# EasyEDA schematic SCH_Device_2024-05-04.json
TITLE: CodexScope; REV: 1.0; Date: 2024-04-23; Sheet: 1/1; Company: N/A
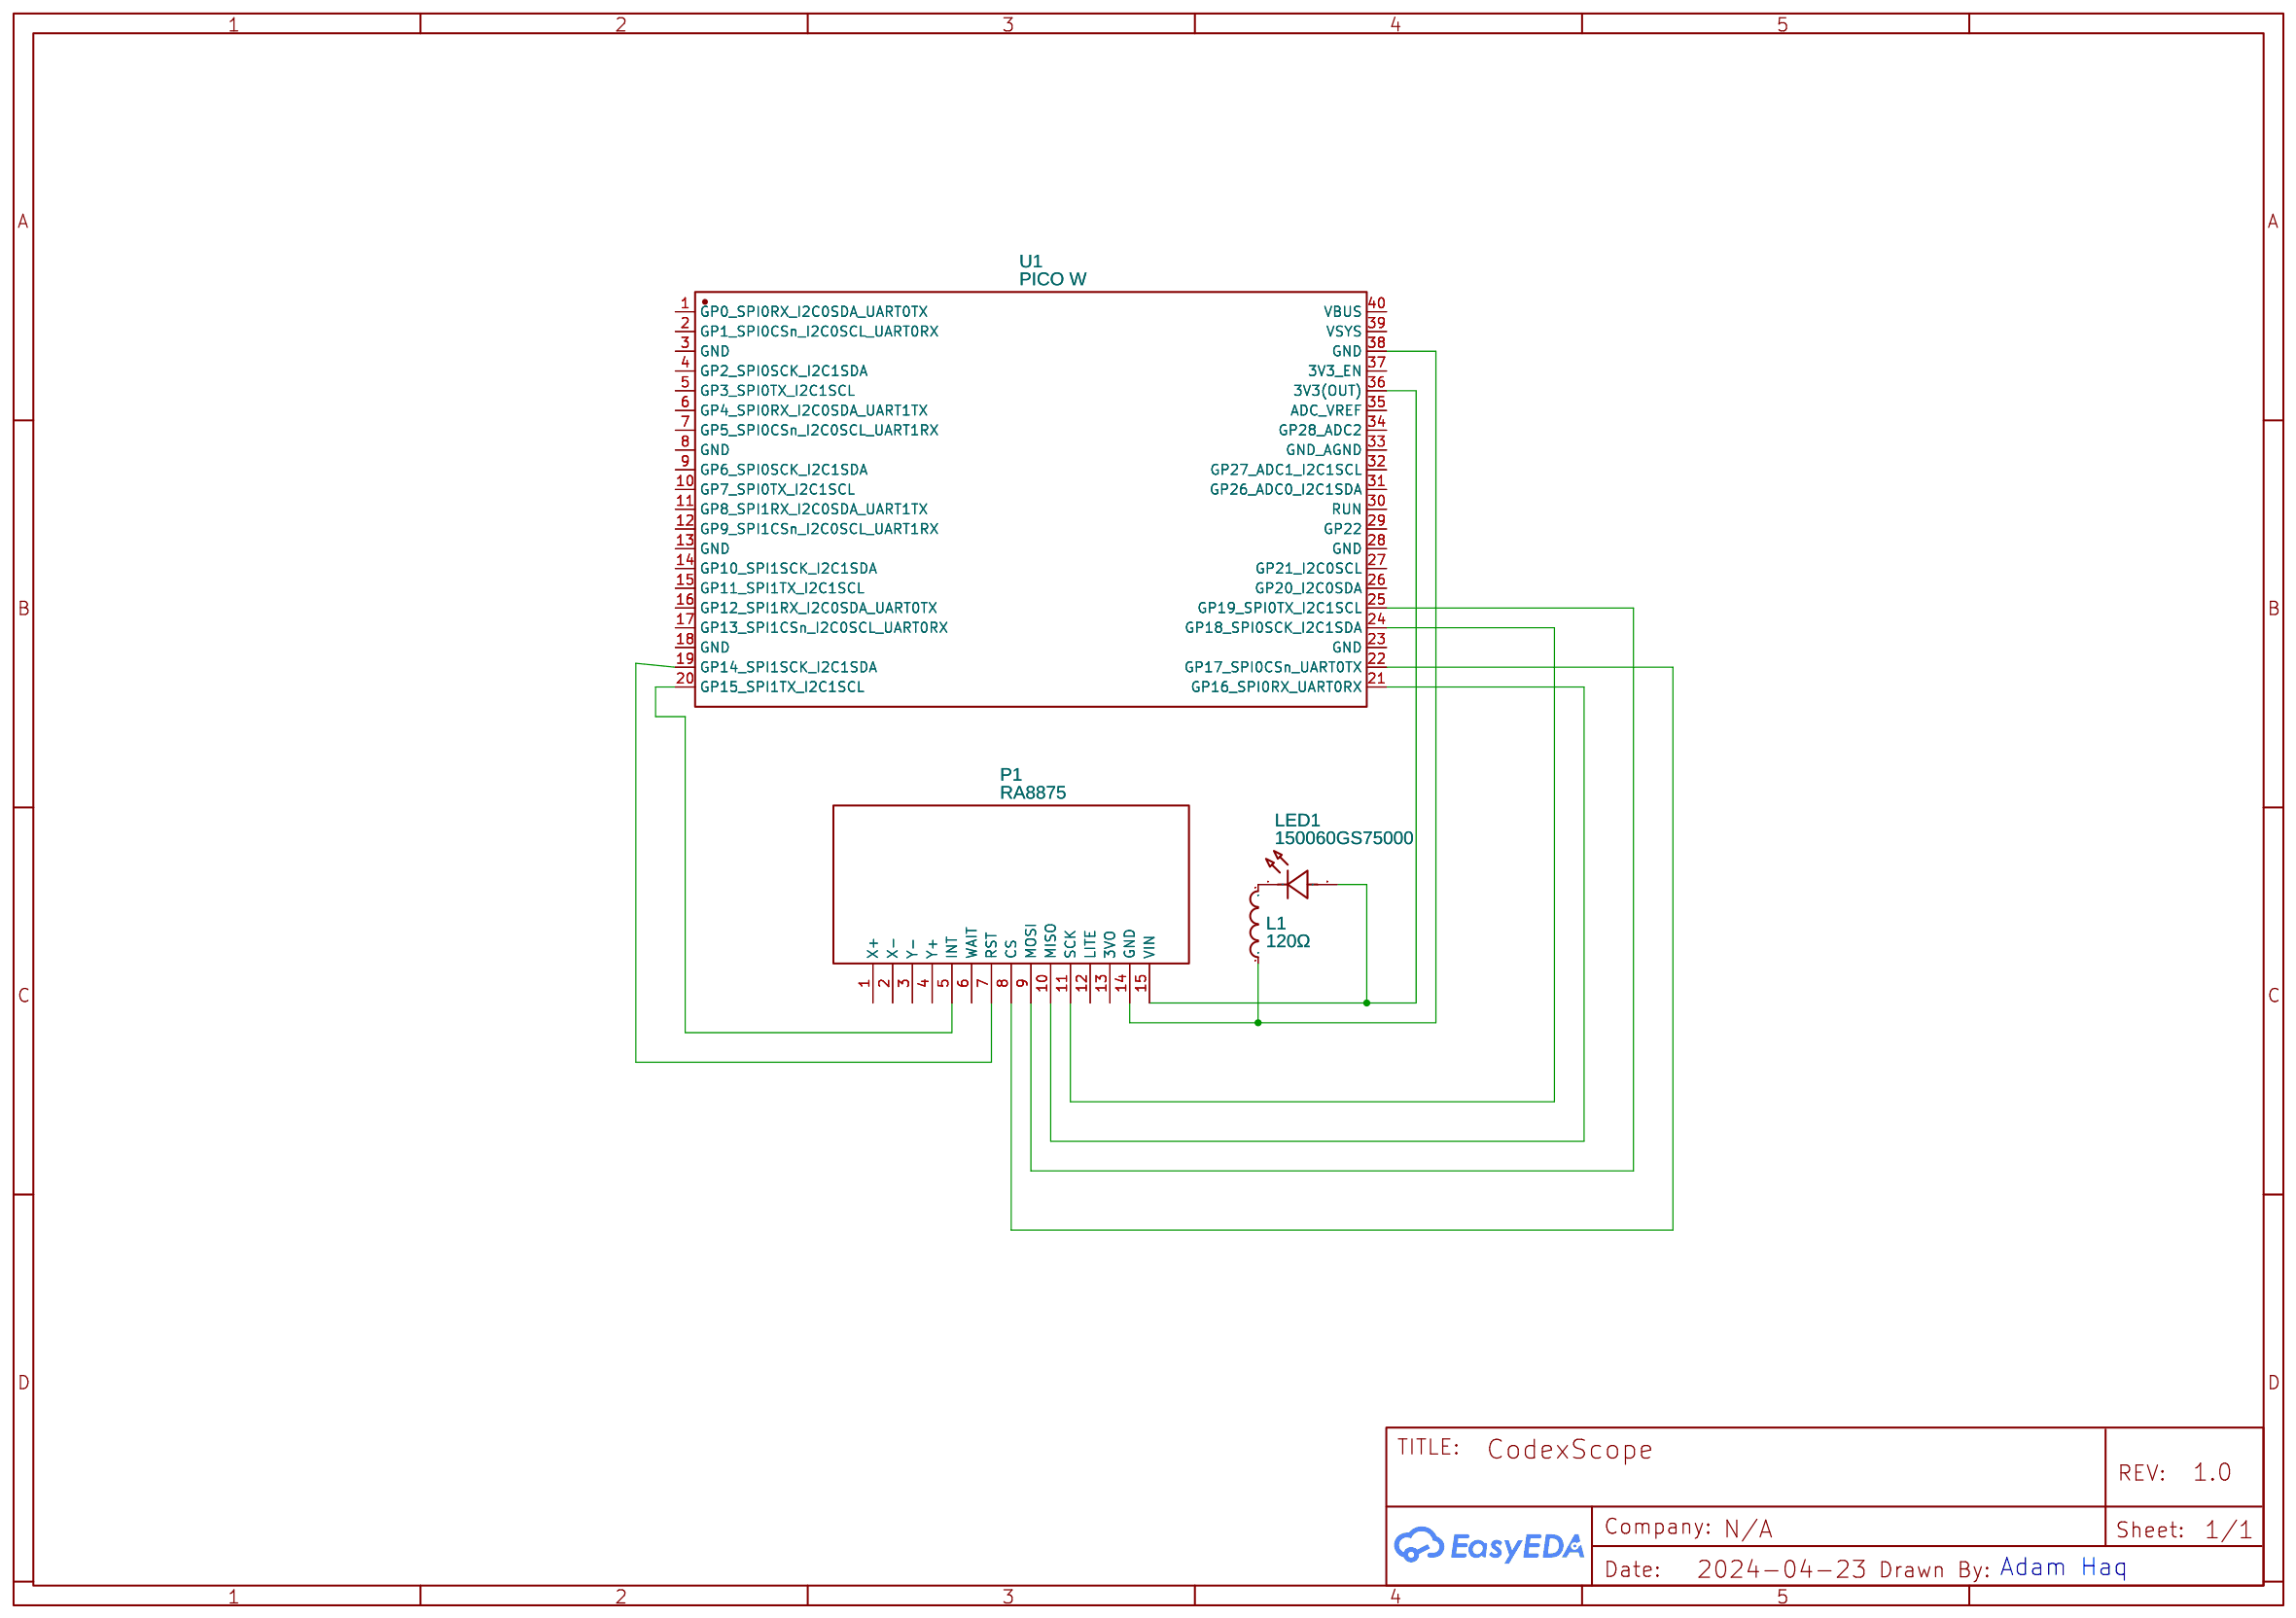
[diagram p0: schematic sheet]

## Parts
L1  120Ω  [L0603]
LED1  150060GS75000  [LED0603-RD_GREEN]
P1  RA8875  [RA8875]
U1  PICO W  [LCC-40_L51.0-W21.0-P2.54-BL_RP2040-BASED]

## Library data of the parts
L1 = MPZ1608S121ATAH0: Supplier: LCSC; Manufacturer: TDK; Supplier Part: C114770; JLCPCB Part Class: Extended Part
LED1 = 150060GS75000: Supplier: LCSC; Supplier Part: C5252984; Manufacturer: Wurth(伍尔特); JLCPCB Part Class: Extended Part; Contributor: lcsc
P1 = RA8875: sourceId: 1T5FDZYC8
U1 = PICO W: Supplier: LCSC; Supplier Part: C7203003; Manufacturer: Raspberry Pi(树莓派); Contributor: lcsc; JLCPCB Part Class: Extended Part

## Nets
Net-(L1-1): L1.1 P1.14(GND) U1.38(GND)
Net-(L1-2): L1.2 LED1.1(K)
Net-(LED1-2): LED1.2(A) P1.15(VIN) U1.36(3V3(OUT))
Net-(P1-5): P1.5(INT) U1.20(GP15_SPI1TX_I2C1SCL)
Net-(P1-7): P1.7(RST) U1.19(GP14_SPI1SCK_I2C1SDA)
Net-(P1-8): P1.8(CS) U1.22(GP17_SPI0CSn_UART0TX)
Net-(P1-9): P1.9(MOSI) U1.25(GP19_SPI0TX_I2C1SCL)
Net-(P1-10): P1.10(MISO) U1.21(GP16_SPI0RX_UART0RX)
Net-(P1-11): P1.11(SCK) U1.24(GP18_SPI0SCK_I2C1SDA)

Not connected (* = marked no-connect by the designer): P1 1(X+) 2(X-) 3(Y-) 4(Y+) 6(WAIT) 12(LITE) 13(3VO); U1 1(GP0_SPI0RX_I2C0SDA_UART0TX) 2(GP1_SPI0CSn_I2C0SCL_UART0RX) 3(GND) 4(GP2_SPI0SCK_I2C1SDA) 5(GP3_SPI0TX_I2C1SCL) 6(GP4_SPI0RX_I2C0SDA_UART1TX) 7(GP5_SPI0CSn_I2C0SCL_UART1RX) 8(GND) 9(GP6_SPI0SCK_I2C1SDA) 10(GP7_SPI0TX_I2C1SCL) 11(GP8_SPI1RX_I2C0SDA_UART1TX) 12(GP9_SPI1CSn_I2C0SCL_UART1RX) 13(GND) 14(GP10_SPI1SCK_I2C1SDA) 15(GP11_SPI1TX_I2C1SCL) 16(GP12_SPI1RX_I2C0SDA_UART0TX) 17(GP13_SPI1CSn_I2C0SCL_UART0RX) 18(GND) 23(GND) 26(GP20_I2C0SDA) 27(GP21_I2C0SCL) 28(GND) 29(GP22) 30(RUN) 31(GP26_ADC0_I2C1SDA) 32(GP27_ADC1_I2C1SCL) 33(GND_AGND) 34(GP28_ADC2) 35(ADC_VREF) 37(3V3_EN) 39(VSYS) 40(VBUS)

## Notes on the sheet
- Adam Haq
